# EAGLE schematic JackPots (EAGLE 6.6.0)
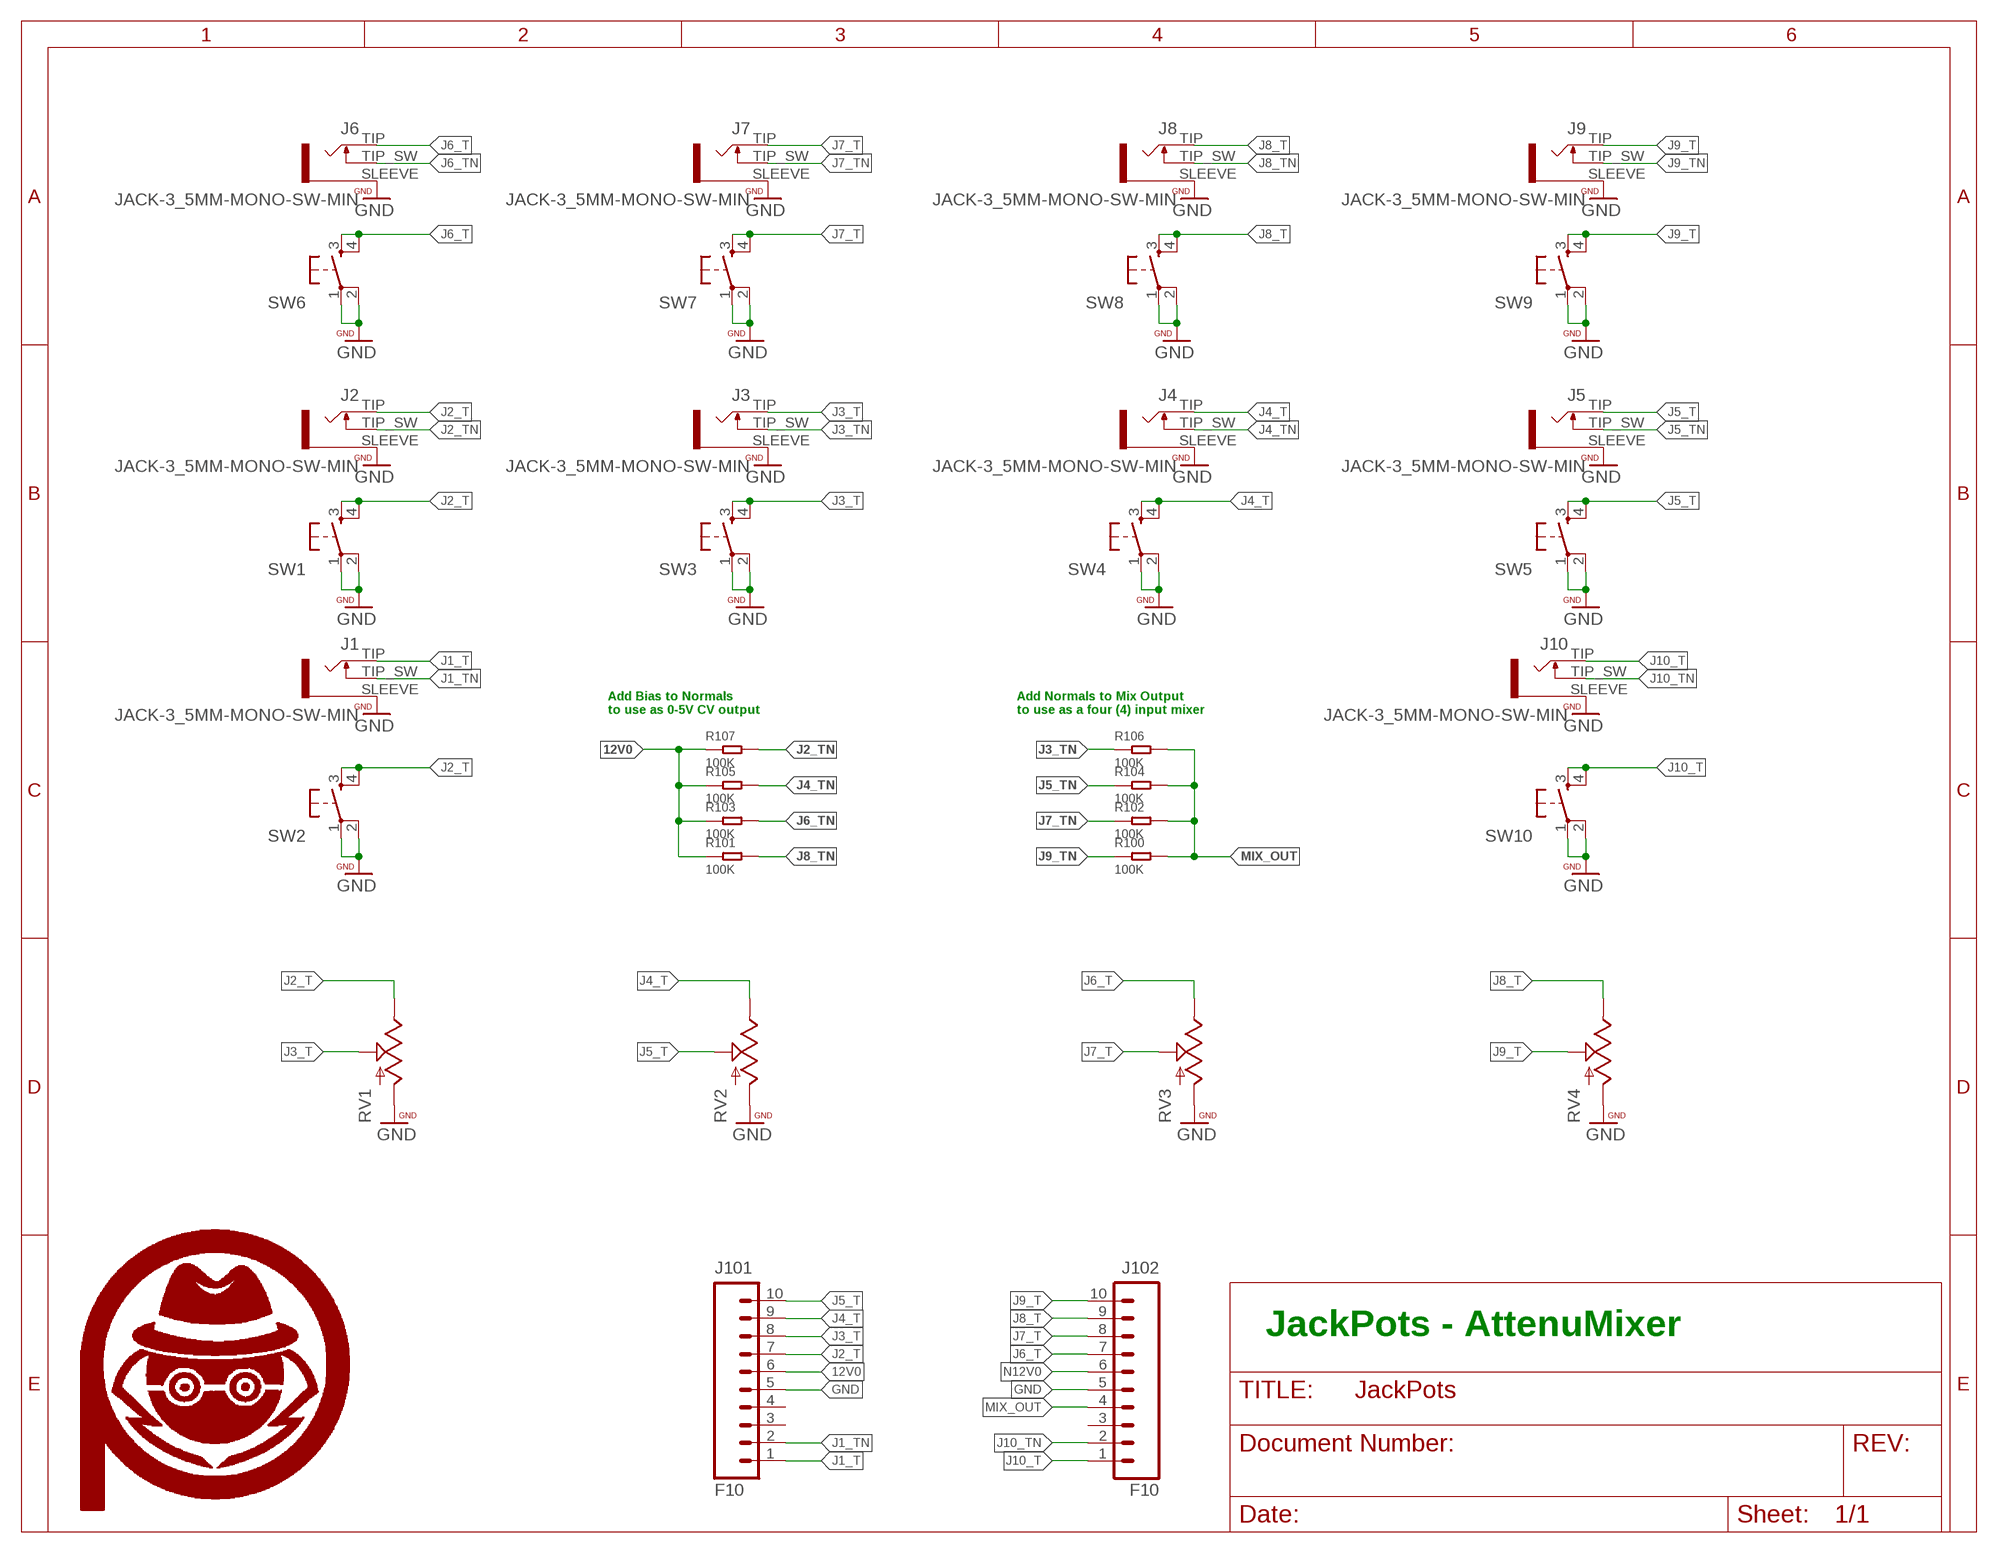
[diagram p0: schematic, sheet 1]

## Parts
$$U$1  PA_LOGO_SYMSMALL  [PA_LOGO_AGENT_SMALL_SYM]
$$U$100  PA_LOGO_SYMMED  [PA_LOGO_AGENT_MED_SYM]
$$U$101  PA_LOGO_SYMMED  [PA_LOGO_AGENT_MED_SYM]
J1  JACK-3_5MM-MONO-SW-MIN  [WQP_PJ301M-MIN]
J2  JACK-3_5MM-MONO-SW-MIN  [WQP_PJ301M-MIN]
J3  JACK-3_5MM-MONO-SW-MIN  [WQP_PJ301M-MIN]
J4  JACK-3_5MM-MONO-SW-MIN  [WQP_PJ301M-MIN]
J5  JACK-3_5MM-MONO-SW-MIN  [WQP_PJ301M-MIN]
J6  JACK-3_5MM-MONO-SW-MIN  [WQP_PJ301M-MIN]
J7  JACK-3_5MM-MONO-SW-MIN  [WQP_PJ301M-MIN]
J8  JACK-3_5MM-MONO-SW-MIN  [WQP_PJ301M-MIN]
J9  JACK-3_5MM-MONO-SW-MIN  [WQP_PJ301M-MIN]
J10  JACK-3_5MM-MONO-SW-MIN  [WQP_PJ301M-MIN]
J101  F10  M10SILK_FEMALE_PTH  [1X10_OCTO]
J102  F10  M10SILK_FEMALE_PTH  [1X10_OCTO]
R100  100K  SMD-RES-100K-1%-1/10W(0603)  [R0603]
R101  100K  SMD-RES-100K-1%-1/10W(0603)  [R0603]
R102  100K  SMD-RES-100K-1%-1/10W(0603)  [R0603]
R103  100K  SMD-RES-100K-1%-1/10W(0603)  [R0603]
R104  100K  SMD-RES-100K-1%-1/10W(0603)  [R0603]
R105  100K  SMD-RES-100K-1%-1/10W(0603)  [R0603]
R106  100K  SMD-RES-100K-1%-1/10W(0603)  [R0603]
R107  100K  SMD-RES-100K-1%-1/10W(0603)  [R0603]
RV1  POT  [ALPS_POT]
RV2  POT  [ALPS_POT]
RV3  POT  [ALPS_POT]
RV4  POT  [ALPS_POT]
SW1  TAC_SWITCHPTH  [TACTILE-PTH]
SW2  TAC_SWITCHPTH  [TACTILE-PTH]
SW3  TAC_SWITCHPTH  [TACTILE-PTH]
SW4  TAC_SWITCHPTH  [TACTILE-PTH]
SW5  TAC_SWITCHPTH  [TACTILE-PTH]
SW6  TAC_SWITCHPTH  [TACTILE-PTH]
SW7  TAC_SWITCHPTH  [TACTILE-PTH]
SW8  TAC_SWITCHPTH  [TACTILE-PTH]
SW9  TAC_SWITCHPTH  [TACTILE-PTH]
SW10  TAC_SWITCHPTH  [TACTILE-PTH]

## Nets
12V0: J101.6 R101.1 R103.1 R105.1 R107.1
GND: J1.SLEEVE J2.SLEEVE J3.SLEEVE J4.SLEEVE J5.SLEEVE J6.SLEEVE J7.SLEEVE J8.SLEEVE J9.SLEEVE J10.SLEEVE J101.5 J102.5 RV1.P$3 RV2.P$3 RV3.P$3 RV4.P$3 SW1.1 SW1.2 SW2.1 SW2.2 SW3.1 SW3.2 SW4.1 SW4.2 SW5.1 SW5.2 SW6.1 SW6.2 SW7.1 SW7.2 SW8.1 SW8.2 SW9.1 SW9.2 SW10.1 SW10.2
J1_T: J1.TIP J101.1
J1_TN: J1.TIP_SW J101.2
J2_T: J2.TIP J101.7 RV1.P$1 SW1.3 SW1.4 SW2.3 SW2.4
J2_TN: J2.TIP_SW R107.2
J3_T: J3.TIP J101.8 RV1.P$2 SW3.3 SW3.4
J3_TN: J3.TIP_SW R106.1
J4_T: J4.TIP J101.9 RV2.P$1 SW4.3 SW4.4
J4_TN: J4.TIP_SW R105.2
J5_T: J5.TIP J101.10 RV2.P$2 SW5.3 SW5.4
J5_TN: J5.TIP_SW R104.1
J6_T: J6.TIP J102.7 RV3.P$1 SW6.3 SW6.4
J6_TN: J6.TIP_SW R103.2
J7_T: J7.TIP J102.8 RV3.P$2 SW7.3 SW7.4
J7_TN: J7.TIP_SW R102.1
J8_T: J8.TIP J102.9 RV4.P$1 SW8.3 SW8.4
J8_TN: J8.TIP_SW R101.2
J9_T: J9.TIP J102.10 RV4.P$2 SW9.3 SW9.4
J9_TN: J9.TIP_SW R100.1
J10_T: J10.TIP J102.1 SW10.3 SW10.4
J10_TN: J10.TIP_SW J102.2
MIX_OUT: J102.4 R100.2 R102.2 R104.2 R106.2
N12V0: J102.6
Unconnected: J101.3 J101.4 J102.3

## Notes on the sheet
- Add Bias to Normals
  to use as 0-5V CV output
- Add Normals to Mix Output
  to use as a four (4) input mixer
- JackPots - AttenuMixer

## Library data of the parts
$$U$1 $$U$100 $$U$101 = PatternAgents-Logos:PA_LOGO_SYM: PatternAgents Logo Symbol Trademark : PatternAgents, LLC Github : https://github.com/PatternAgents/PCB_Libraries License : http://creativecommons.org/licenses/by-sa/3.0/ (Creative Commons 3.0) THIS SOFTWARE IS PROVIDED BY THE CONTRIBUTORS "AS IS" AND WITHOUT ANY EXPRESS OR IMPLIED WARRANTIES, INCLUDING, BUT NOT LIMITED TO, THE IMPLIED WARRANTIES OF MERCHANTABILITY AND FITNESS FOR A PARTICULAR PURPOSE ARE DISCLAIMED. IN NO EVENT SHALL THE COPYRIGHT OWNER OR CONTRIBUTORS BE LIABLE FOR ANY DIRECT, INDIRECT, INCIDENTAL, SPECIAL, EXEMPLARY, OR CONSEQUENTIAL DAMAGES (INCLUDING, BUT NOT LIMITED TO, PROCUREMENT OF SUBSTITUTE GOODS OR SERVICES; LOSS OF USE, DATA, OR PROFITS; OR BUSINESS INTERRUPTION) HOWEVER CAUSED AND ON ANY THEORY OF LIABILITY, WHETHER IN CONTRACT, STRICT LIABILITY, OR TORT (INCLUDING NEGLIGENCE OR OTHERWISE) ARISING IN ANY WAY OUT OF THE USE OF THIS SOFTWARE, EVEN IF ADVISED OF THE POSSIBILITY OF SUCH DAMAGE.
J1-J10 = halcyonmod_Connectors:JACK-3_5MM-MONO-SW: Jack, 3.5mm, RIght Angle, Though-Hole
J101 J102 = oXo_Connectors:M10: Header 10 Standard 10-pin 0.1" header. Use with straight break away headers (SKU : PRT-00116), right angle break away headers (PRT-00553), swiss pins (PRT-00743), machine pins (PRT-00117), and female headers (PRT-00115).; PROD_ID: CONN-11563
R100-R107 = Seeed-Resistor-2016:SMD-RES-100K-1%-1/10W(0603): 301010196; MPN: RC0603FR-07100KL
RV1-RV4 = halcyonmod_Potentiometers:POT; PROD_ID: RES-09177
SW1-SW10 = SparkFun:TAC_SWITCH: Momentary Switch Button commonly used for reset or general input. Spark Fun Electronics SKU : COM-00097